# EasyEDA Pro project 嵌入式STC51测电压工程_2024_11_11.epro, board 测电压课设简单版本
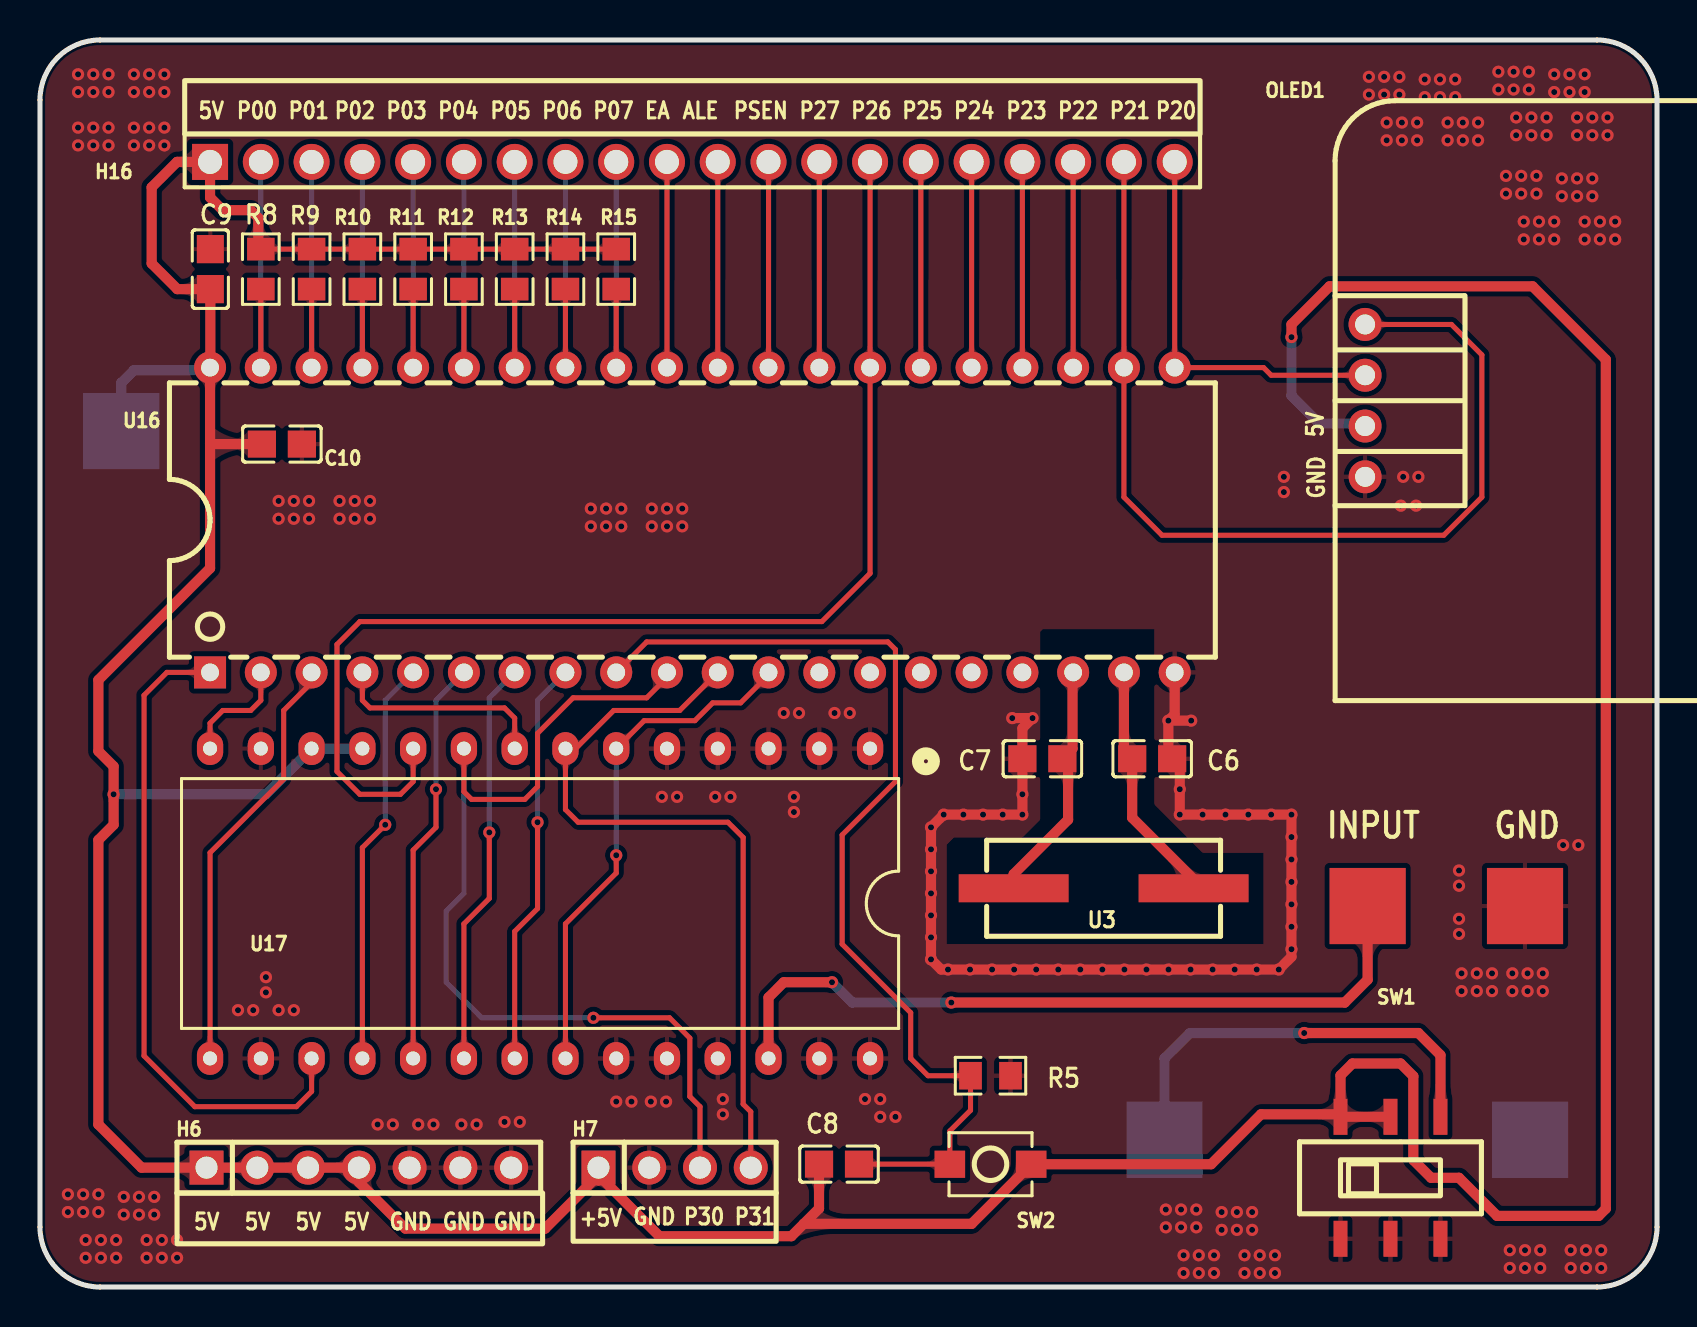
[diagram p1: board, top side]
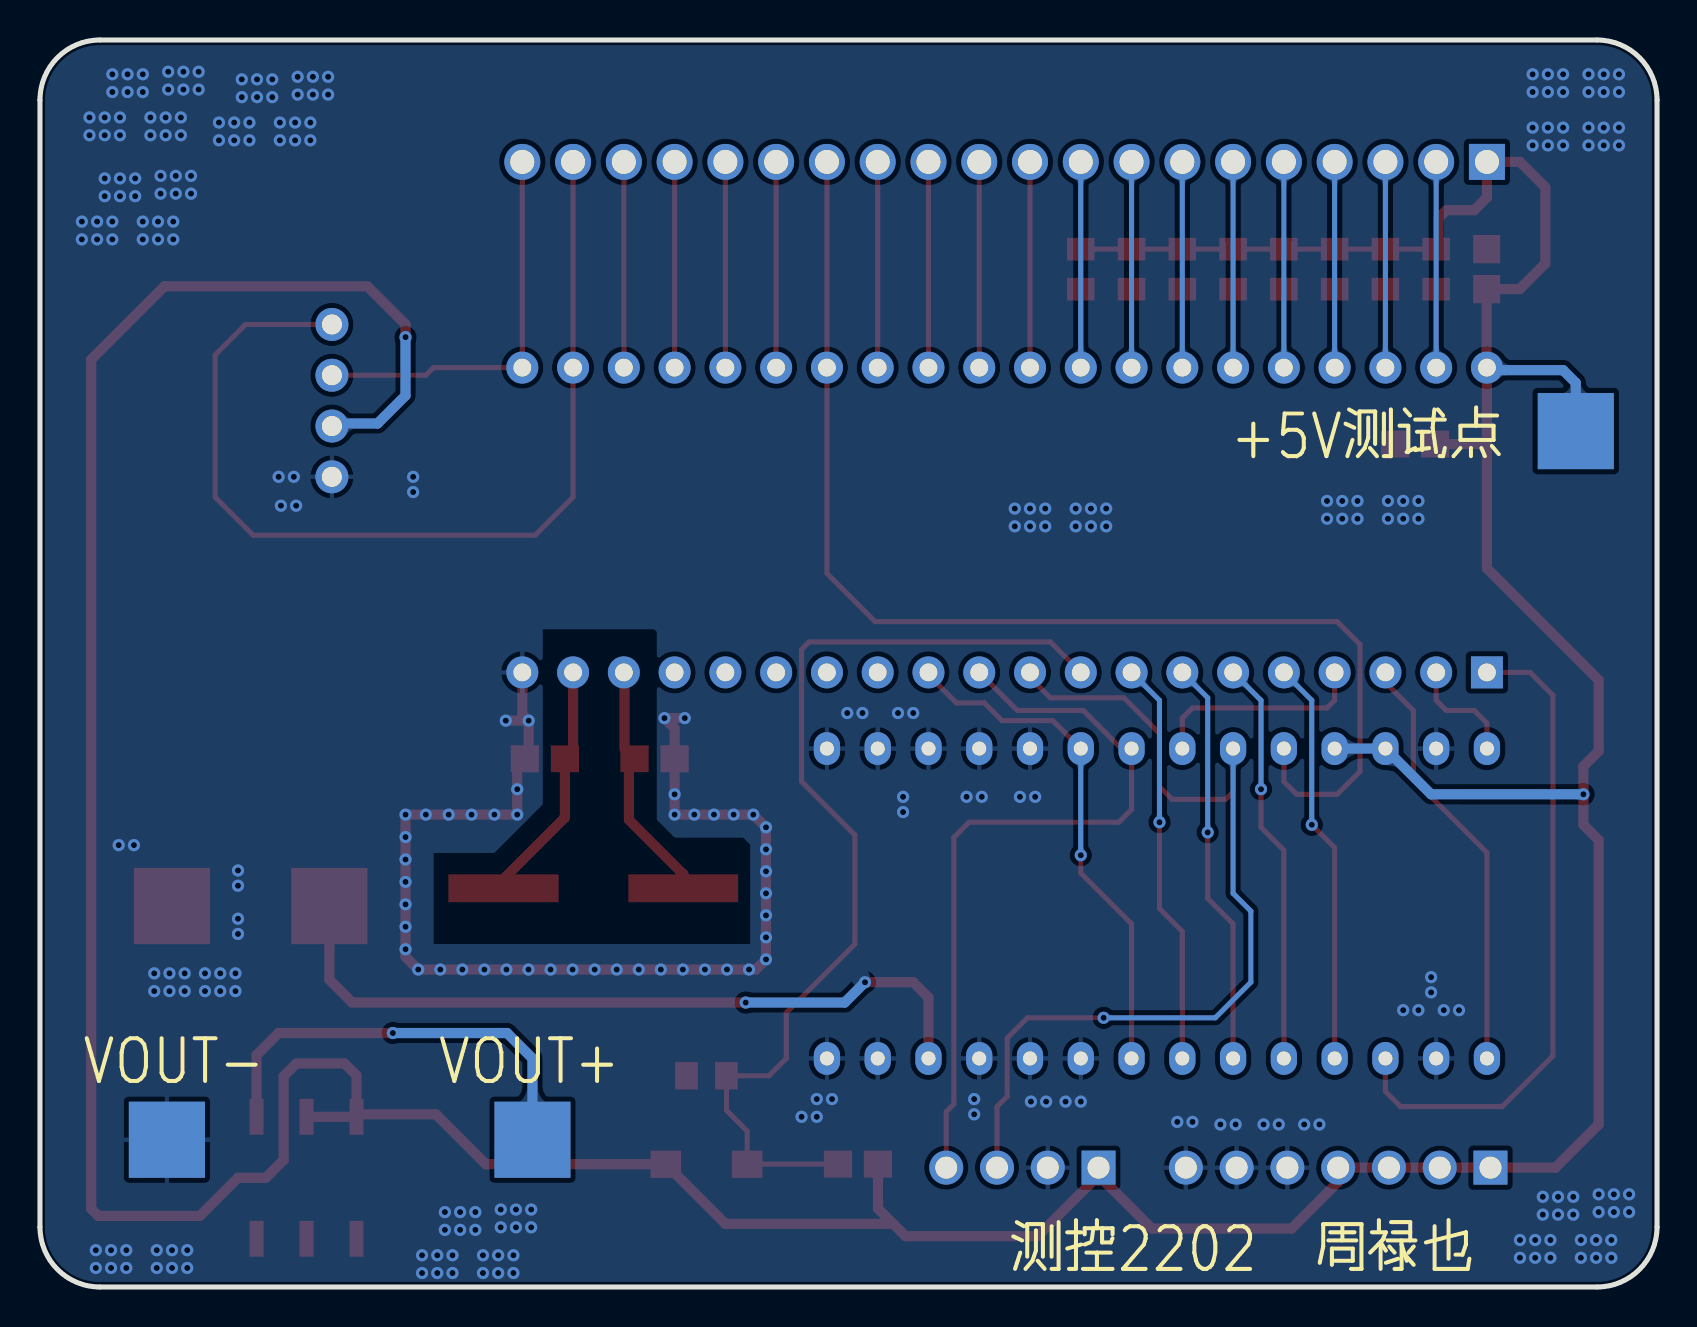
[diagram p2: board, bottom side, seen from below]

Outline 80.9 x 62.36 mm; copper layers: Top Layer, Bottom Layer. Coordinates in mm from the lower left corner of the outline.
Outline path: 0,59.36 0,3 arc(0.88,0.88) 3,0 77.9,0 arc(80.02,0.88) 80.9,3 80.9,59.36 arc(80.02,61.48) 77.9,62.36 3,62.36 arc(0.88,61.48) 0,59.36
Stack: Top Layer 0.035mm / Dielectric1 1.51mm FR4 er 4.5 / Bottom Layer 0.035mm

## Design rules (mm)
net XTAL1: DP1
net XTAL2: DP1
template: JLCPCB Capability(Two Layers Board)
spacing copperThickness1oz (default): track to track 0.102, other pairs 0.152 to 0.3
spacing copperThickness2oz: track to track 0.203, other pairs 0.152 to 0.3
track width copperThickness1oz (default): min 0.127, default 0.254, max 2.54
track width copperThickness2oz: min 0.203, default 0.254, max 2.54
differential pair differentialPair (default): width min 0.127, default 0.254, max 2.54; gap min 0.152, default 0.152
via viaSize (default): diameter min 0.5, default 0.61, max 10; hole min 0.3, default 0.305, max 6.3

## Placement (name value [footprint] x y rotation side)
C6  47PF  [C0805]  55.64 26.42 180 top
C7  47PF  [C0805]  50.15 26.42 0 top
C8  10uF  [C0805]  39.98 6.14 180 top
C9  100nF  [C0805]  8.52 50.9 90 top
C10  10uF  [C0805]  12.1 42.15 180 top
H6  -  [HDR-TH_7P-P2.54-V-M]  15.95 5.97 0 top
H7  -  [HDR-TH_4P-P2.54-V-M]  31.75 5.97 0 top
H16  -  [HDR-TH_20P-P2.54-V-M-1]  32.64 56.26 0 top
NOREF  -  [Pad_e1104]  74.55 7.37 0 top
NOREF#2  -  [Pad_e2425]  74.3 19.05 0 top
NOREF#3  -  [Pad_e1102]  56.26 7.37 0 top
NOREF#4  -  [Pad_e3894]  4.06 42.8 0 top
NOREF#5  -  [Pad_e2426]  66.42 19.05 0 top
OLED1  -  [0.96OLED_4P]  66.29 44.32 90 top
R5  10K  [R0805]  47.55 10.57 180 top
R8  5.1k  [R0805]  11.05 50.9 90 top
R9  5.1k  [R0805]  13.59 50.9 90 top
R10  5.1k  [R0805]  16.13 50.9 90 top
R11  5.1k  [R0805]  18.67 50.9 90 top
R12  5.1k  [R0805]  21.21 50.9 90 top
R13  5.1k  [R0805]  23.75 50.9 90 top
R14  5.1k  [R0805]  26.29 50.9 90 top
R15  5.1k  [R0805]  28.83 50.9 90 top
SW1  SS-3235S-L1  [SW-SMD_SS-3235S-LX]  67.56 5.46 180 top
SW2  轻触按键3*4*H  [SW-SMD_L4.0-W2.9-LS5.0]  47.55 6.14 180 top
U3  12MHz  [CRYSTAL-SMD_L11.4-W4.7-LS12.7]  53.21 19.94 0 top
U16  STC89C52RC-40I-PDIP40  [DIP-40_L52.0-W13.7-P2.54-LS15.2-BL]  32.64 38.35 0 top
U17  ADC0809CCN  [PDIP-28_L36.0-W13.0-P2.54-LS15.5-BL]  25.02 19.18 180 top

## Footprints (pads in the part's own frame, mm; a bottom-side part is the same pattern mirrored in y, then rotated)
0.96OLED_4P
  round 1.65 hole 1: 1(-3.81,-0.002) 2(-1.27,0.002) 3(1.27,0.002) 4(3.81,0.002)
C0805
  rect 1.41x1.35 smd: 1(-1,0) 2(1,0)
CRYSTAL-SMD_L11.4-W4.7-LS12.7
  rect 5.5x1.4 smd: 1(-4.5,0) 2(4.5,0)
DIP-40_L52.0-W13.7-P2.54-LS15.2-BL
  rect 1.6x1.6 hole 0.889: 1(-24.13,-7.62)
  round 1.6 hole 0.889: 2(-21.59,-7.62) 3(-19.05,-7.62) 4(-16.51,-7.62) 5(-13.97,-7.62) 6(-11.43,-7.62) 7(-8.89,-7.62) 8(-6.35,-7.62) 9(-3.81,-7.62) 10(-1.27,-7.62) 11(1.27,-7.62) 12(3.81,-7.62) 13(6.35,-7.62) 14(8.89,-7.62) 15(11.43,-7.62) 16(13.97,-7.62) 17(16.51,-7.62) 18(19.05,-7.62) 19(21.59,-7.62) 20(24.13,-7.62) 21(24.13,7.62) 22(21.59,7.62) 23(19.05,7.62) 24(16.51,7.62) 25(13.97,7.62) 26(11.43,7.62) 27(8.89,7.62) 28(6.35,7.62) 29(3.81,7.62) 30(1.27,7.62) 31(-1.27,7.62) 32(-3.81,7.62) 33(-6.35,7.62) 34(-8.89,7.62) 35(-11.43,7.62) 36(-13.97,7.62) 37(-16.51,7.62) 38(-19.05,7.62) 39(-21.59,7.62) 40(-24.13,7.62)
HDR-TH_4P-P2.54-V-M
  rect 1.7x1.7 hole 1.1: 1(-3.81,0)
  round 1.7 hole 1.1: 2(-1.27,0) 3(1.27,0) 4(3.81,0)
HDR-TH_7P-P2.54-V-M
  rect 1.7x1.7 hole 1.1: 1(-7.62,0)
  round 1.7 hole 1.1: 2(-5.08,0) 3(-2.54,0) 4(0,0) 5(2.54,0) 6(5.08,0) 7(7.62,0)
HDR-TH_20P-P2.54-V-M-1
  rect 1.8x1.8 hole 1.2: 1(-24.13,0)
  round 1.8 hole 1.2: 2(-21.59,0) 3(-19.05,0) 4(-16.51,0) 5(-13.97,0) 6(-11.43,0) 7(-8.89,0) 8(-6.35,0) 9(-3.81,0) 10(-1.27,0) 11(1.27,0) 12(3.81,0) 13(6.35,0) 14(8.89,0) 15(11.43,0) 16(13.97,0) 17(16.51,0) 18(19.05,0) 19(21.59,0) 20(24.13,0)
Pad_e1102
  rect 3.81x3.81 smd far side: 1(0,0)
Pad_e1104
  rect 3.81x3.81 smd far side: 1(0,0)
Pad_e2425
  rect 3.81x3.81 smd: 1(0,0)
Pad_e2426
  rect 3.81x3.81 smd: 1(0,0)
Pad_e3894
  rect 3.81x3.81 smd far side: 1(0,0)
PDIP-28_L36.0-W13.0-P2.54-LS15.5-BL
  oval 1.314x1.643 hole 0.7: 1(-16.51,-7.747) 2(-13.97,-7.747) 3(-11.43,-7.747) 4(-8.89,-7.747) 5(-6.35,-7.747) 6(-3.81,-7.747) 7(-1.27,-7.747) 8(1.27,-7.747) 9(3.81,-7.747) 10(6.35,-7.747) 11(8.89,-7.747) 12(11.43,-7.747) 13(13.97,-7.747) 14(16.51,-7.747) 15(16.51,7.747) 16(13.97,7.747) 17(11.43,7.747) 18(8.89,7.747) 19(6.35,7.747) 20(3.81,7.747) 21(1.27,7.747) 22(-1.27,7.747) 23(-3.81,7.747) 24(-6.35,7.747) 25(-8.89,7.747) 26(-11.43,7.747) 27(-13.97,7.747) 28(-16.51,7.747)
R0805
  rect 1.133x1.377 smd: 1(-1,0) 2(1,0)
SW-SMD_L4.0-W2.9-LS5.0
  rect 1.53x1.36 smd: 1(-2.035,0) 2(2.035,0)
SW-SMD_SS-3235S-LX
  rect 0.7x1.8 smd: 1(-2.5,3.05) 2(0,3.05) 3(2.5,3.05) 4(-2.5,-3.05) 5(0,-3.05) 6(2.5,-3.05)

## Nets
As in the schematic, except:
+5V: C8.2 C9.1 C10.2 H6.1 H6.2 H6.3 H6.4 H7.1 H16.1 NOREF#4.1 OLED1.2 R8.2 R9.2 R10.2 R11.2 R12.2 R13.2 R14.2 R15.2 SW1.5 SW1.6 SW2.1 U16.40 U17.11 U17.12
GND: C6.1 C7.1 C9.2 C10.1 H6.5 H6.6 H6.7 H7.2 NOREF.1 NOREF#2.1 OLED1.1 R5.1 SW1.1 SW1.2 SW1.3 U16.20 U17.1 U17.2 U17.3 U17.4 U17.5 U17.13 U17.16 U17.23 U17.24 U17.25 U17.27 U17.28
INPUT: NOREF#5.1 U17.26
P2.0: H16.20 OLED1.3 U16.21
P2.1: H16.19 OLED1.4 U16.22
VOUT+: NOREF#3.1 SW1.4

## Via types
v1: diameter 0.61, hole 0.305, Top Layer to Bottom Layer, 295 vias

## Routing (per net, layer and track width the routed paths; a pad name or vN(x,y) marks a point on that pad's centre or on a via; arc(x,y) is an arc through that point)
+5V: length 268.2
  Top Layer w0.254: R8.2 R9.2 R10.2 R11.2 R12.2 R13.2 R14.2 R15.2
  Top Layer w0.508: C8.2 38.98,3.92 38.21,3.16 ; 8.51,42.17 U16.40 8.52,45.99 C9.1 6.87,49.9 5.59,51.18 5.59,54.99 6.86,56.26 H16.1 8.51,54.48 9.14,53.85 10.54,53.85 10.92,53.47 10.92,52.03 R8.2 ; 8.51,42.17 8.53,42.15 C10.2 ; 8.51,42.17 8.51,35.94 2.92,30.35 2.92,26.8 3.68,26.04 v1(3.68,24.64) 3.68,23.11 2.92,22.35 2.92,8.13 5.08,5.97 H6.2 H6.4 15.95,5.25 18.28,2.92 25.27,2.92 27.69,5.33 27.94,5.33 ; 27.94,5.33 H7.1 ; 27.94,5.33 28.19,5.33 30.99,2.54 37.59,2.54 38.21,3.16 ; SW1.6 65.06,10.58 65.66,11.18 68.07,11.18 68.71,10.54 68.71,6.35 69.6,5.46 70.99,5.46 72.9,3.56 77.98,3.56 78.34,3.92 78.34,46.38 74.68,50.04 64.52,50.04 62.61,48.13 v1(62.61,47.5) ; SW1.6 64.94,8.64 61.09,8.64 58.59,6.14 SW2.1 46.61,3.16 38.21,3.16 ; SW1.6 SW1.5
  Bottom Layer w0.508: v1(3.68,24.64) 11.3,24.64 U17.12 U17.11 ; NOREF#4.1 4.06,45.21 4.7,45.85 8.38,45.85 U16.40 ; v1(62.61,47.5) 62.61,44.58 64.01,43.18 66.17,43.18 OLED1.2
GND: length 57.3
  Top Layer w0.508: v1(56.45,28.32) v1(57.59,28.32) ; v1(56.45,28.32) 56.45,26.61 C6.1 57.02,26.04 v1(57.02,24.89) v1(57.02,23.62) v1(58.17,23.62) v1(59.31,23.62) v1(60.45,23.62) v1(61.6,23.62) v1(62.61,23.62) v1(62.61,22.5) v1(62.61,21.38) v1(62.61,20.26) v1(62.61,19.13) v1(62.61,18.01) v1(62.61,16.89) 62.61,16.51 v1(61.98,15.88) v1(60.87,15.88) v1(59.77,15.88) v1(58.67,15.88) v1(57.56,15.88) v1(56.46,15.88) v1(55.36,15.88) v1(54.25,15.88) v1(53.15,15.88) v1(52.05,15.88) v1(50.94,15.88) v1(49.84,15.88) v1(48.74,15.88) v1(47.63,15.88) v1(46.53,15.88) v1(45.43,15.88) 45.08,15.88 v1(44.58,16.38) v1(44.58,17.48) v1(44.58,18.58) v1(44.58,19.69) v1(44.58,20.79) v1(44.58,21.89) v1(44.58,22.99) v1(45.21,23.62) v1(46.2,23.62) v1(47.18,23.62) v1(48.17,23.62) v1(49.15,23.62) v1(49.15,24.64) C7.1 49.15,27.94 v1(49.66,28.45) v1(48.64,28.45) ; v1(56.45,28.32) 56.77,28.64 U16.20
  vias: v1(1.4,4.64) v1(1.4,3.75) v1(1.91,60.64) v1(1.91,59.75) v1(1.91,57.98) v1(1.91,57.09) v1(2.16,4.64) v1(2.16,3.75) v1(2.29,2.35) v1(2.29,1.46) v1(2.67,60.64) v1(2.67,59.75) v1(2.67,57.98) v1(2.67,57.09) v1(2.92,4.64) v1(2.92,3.75) v1(3.05,2.35) v1(3.05,1.46) v1(3.43,60.64) v1(3.43,59.75) v1(3.43,57.98) v1(3.43,57.09) v1(3.81,2.35) v1(3.81,1.46) v1(4.19,4.51) v1(4.19,3.62) v1(4.7,60.64) v1(4.7,59.75) v1(4.7,57.98) v1(4.7,57.09) v1(4.95,4.51) v1(4.95,3.62) v1(5.33,2.35) v1(5.33,1.46) v1(5.46,60.64) v1(5.46,59.75) v1(5.46,57.98) v1(5.46,57.09) v1(5.72,4.51) v1(5.72,3.62) v1(6.1,2.35) v1(6.1,1.46) v1(6.22,60.64) v1(6.22,59.75) v1(6.22,57.98) v1(6.22,57.09) v1(6.86,2.35) v1(6.86,1.46) v1(9.91,13.84) v1(10.67,13.84) v1(11.3,15.49) v1(11.3,14.73) v1(11.94,39.31) v1(11.94,38.42) v1(11.94,13.84) v1(12.7,39.31) v1(12.7,38.42) v1(12.7,13.84) v1(13.46,39.31) v1(13.46,38.42) v1(14.99,39.31) v1(14.99,38.42) v1(15.75,39.31) v1(15.75,38.42) v1(16.51,39.31) v1(16.51,38.42) v1(16.89,8.13) v1(17.65,8.13) v1(18.92,8.13) v1(19.69,8.13) v1(21.08,8.13) v1(21.84,8.13) v1(23.24,8.26) v1(24,8.26) v1(27.56,38.93) v1(27.56,38.04) v1(28.32,38.93) v1(28.32,38.04) v1(28.83,9.27) v1(29.08,38.93) v1(29.08,38.04) v1(29.59,9.27) v1(30.61,38.93) v1(30.61,38.04) v1(30.56,9.27) v1(31.11,24.51) v1(31.37,38.93) v1(31.37,38.04) v1(31.32,9.27) v1(31.87,24.51) v1(32.13,38.93) v1(32.13,38.04) v1(33.78,24.51) v1(34.16,9.4) v1(34.16,8.64) v1(34.54,24.51) v1(37.21,28.7) v1(37.72,24.51) v1(37.72,23.75) v1(37.97,28.7) v1(39.75,28.7) v1(40.51,28.7) v1(41.27,9.4) v1(42.04,9.4) v1(42.04,8.51) v1(42.8,8.51) v1(56.32,3.87) v1(56.32,2.98) v1(57.09,3.87) v1(57.09,2.98) v1(57.21,1.59) v1(57.21,0.7) v1(57.85,3.87) v1(57.85,2.98) v1(57.98,1.59) v1(57.98,0.7) v1(58.74,1.59) v1(58.74,0.7) v1(59.12,3.75) v1(59.12,2.86) v1(59.88,3.75) v1(59.88,2.86) v1(60.26,1.59) v1(60.26,0.7) v1(60.64,3.75) v1(60.64,2.86) v1(61.02,1.59) v1(61.02,0.7) v1(61.79,1.59) v1(61.79,0.7) v1(62.23,40.51) v1(62.23,39.75) v1(66.48,60.52) v1(66.48,59.63) v1(67.25,60.52) v1(67.25,59.63) v1(67.37,58.23) v1(67.37,57.34) v1(68.01,60.52) v1(68.01,59.63) v1(68.08,39.07) v1(68.14,58.23) v1(68.14,57.34) v1(68.2,40.51) v1(68.9,58.23) v1(68.9,57.34) v1(68.85,39.07) v1(68.96,40.51) v1(69.28,60.39) v1(69.28,59.5) v1(70.04,60.39) v1(70.04,59.5) v1(70.42,58.23) v1(70.42,57.34) v1(70.8,60.39) v1(70.8,59.5) v1(70.99,20.83) v1(70.99,20.07) v1(70.99,18.42) v1(70.99,17.65) v1(71.12,15.68) v1(71.12,14.8) v1(71.18,58.23) v1(71.18,57.34) v1(71.88,15.68) v1(71.88,14.8) v1(71.95,58.23) v1(71.95,57.34) v1(72.64,15.68) v1(72.64,14.8) v1(72.96,60.77) v1(72.96,59.88) v1(73.34,55.56) v1(73.34,54.67) v1(73.53,1.84) v1(73.53,0.95) v1(73.66,15.68) v1(73.66,14.8) v1(73.72,60.77) v1(73.72,59.88) v1(73.85,58.48) v1(73.85,57.59) v1(74.1,55.56) v1(74.1,54.67) v1(74.23,53.28) v1(74.23,52.39) v1(74.3,1.84) v1(74.3,0.95) v1(74.42,15.68) v1(74.42,14.8) v1(74.49,60.77) v1(74.49,59.88) v1(74.61,58.48) v1(74.61,57.59) v1(74.87,55.56) v1(74.87,54.67) v1(74.99,53.28) v1(74.99,52.39) v1(75.06,1.84) v1(75.06,0.95) v1(75.18,15.68) v1(75.18,14.8) v1(75.37,58.48) v1(75.37,57.59) v1(75.76,60.64) v1(75.76,59.75) v1(75.76,53.28) v1(75.76,52.39) v1(76.14,55.44) v1(76.14,54.55) v1(76.2,22.1) v1(76.52,60.64) v1(76.52,59.75) v1(76.58,1.84) v1(76.58,0.95) v1(76.9,58.48) v1(76.9,57.59) v1(76.9,55.44) v1(76.9,54.55) v1(76.96,22.1) v1(77.28,60.64) v1(77.28,59.75) v1(77.28,53.28) v1(77.28,52.39) v1(77.34,1.84) v1(77.34,0.95) v1(77.66,58.48) v1(77.66,57.59) v1(77.66,55.44) v1(77.66,54.55) v1(78.04,53.28) v1(78.04,52.39) v1(78.11,1.84) v1(78.11,0.95) v1(78.42,58.48) v1(78.42,57.59) v1(78.8,53.28) v1(78.8,52.39)
ALE: length 10.3
  Top Layer w0.254: H16.11 U16.30
EA: length 10.3
  Top Layer w0.254: H16.10 U16.31
INPUT: length 37.9
  Top Layer w0.508: U17.26 36.45,14.48 37.21,15.24 v1(39.62,15.24) ; v1(45.59,14.22) 65.28,14.22 66.42,15.37 NOREF#5.1
  Bottom Layer w0.508: v1(45.59,14.22) 40.64,14.22 v1(39.62,15.24)
P0.0: length 14.2
  Top Layer w0.254: U16.39 R8.1
  Bottom Layer w0.254: H16.2 U16.39
P0.1: length 14.2
  Top Layer w0.254: U16.38 R9.1
  Bottom Layer w0.254: H16.3 U16.38
P0.2: length 14.2
  Top Layer w0.254: U16.37 R10.1
  Bottom Layer w0.254: H16.4 U16.37
P0.3: length 14.2
  Top Layer w0.254: U16.36 R11.1
  Bottom Layer w0.254: H16.5 U16.36
P0.4: length 14.2
  Top Layer w0.254: U16.35 R12.1
  Bottom Layer w0.254: H16.6 U16.35
P0.5: length 14.2
  Top Layer w0.254: U16.34 R13.1
  Bottom Layer w0.254: H16.7 U16.34
P0.6: length 14.2
  Top Layer w0.254: U16.33 R14.1
  Bottom Layer w0.254: H16.8 U16.33
P0.7: length 14.2
  Top Layer w0.254: U16.32 R15.1
  Bottom Layer w0.254: H16.9 U16.32
P1.0: length 33.2
  Top Layer w0.254: U16.1 6.35,30.73 5.21,29.59 5.21,11.56 7.75,9.02 12.83,9.02 13.59,9.78 U17.17
P1.1: length 5.7
  Top Layer w0.254: U16.2 11.05,29.34 10.54,28.83 9.14,28.83 8.51,28.19 U17.14
P1.2: length 21.4
  Top Layer w0.254: U17.15 8.51,21.72 12.19,25.4 12.19,28.83 13.59,30.23 U16.3
P1.3: length 10.9
  Top Layer w0.254: U17.8 23.75,28.45 23.24,28.96 16.51,28.96 16.13,29.34 U16.4
P1.4: length 20.4
  Top Layer w0.254: U17.18 16.13,21.97 v1(17.27,23.11)
  Bottom Layer w0.254: v1(17.27,23.11) 17.27,29.34 U16.5
P1.5: length 20.4
  Top Layer w0.254: U17.19 18.67,21.84 19.81,22.99 v1(19.81,24.89)
  Bottom Layer w0.254: v1(19.81,24.89) 19.81,29.34 U16.6
P1.6: length 20.4
  Top Layer w0.254: U17.20 21.21,18.16 22.48,19.43 v1(22.48,22.73)
  Bottom Layer w0.254: v1(22.48,22.73) 22.48,29.46 U16.7
P1.7: length 20.4
  Top Layer w0.254: v1(24.89,23.24) 24.89,18.92 23.75,17.78 U17.21
  Bottom Layer w0.254: U16.8 24.89,29.34 v1(24.89,23.24)
P2.0: length 20
  Top Layer w0.254: H16.20 U16.21 61.21,45.97 61.6,45.59 OLED1.3
P2.1: length 49.8
  Top Layer w0.254: OLED1.4 70.61,48.13 72.14,46.61 72.14,39.5 70.23,37.59 56.13,37.59 54.23,39.5 U16.22 H16.19
P2.2: length 10.3
  Top Layer w0.254: H16.18 U16.23
P2.3: length 10.3
  Top Layer w0.254: H16.17 U16.24
P2.4: length 10.3
  Top Layer w0.254: H16.16 U16.25
P2.5: length 10.3
  Top Layer w0.254: H16.15 U16.26
P2.6: length 61.3
  Top Layer w0.254: U17.10 18.67,25.27 18.03,24.64 16,24.64 14.86,25.78 14.86,32.13 16,33.27 39.12,33.27 41.53,35.69 U16.27 H16.14
P2.7: length 10.3
  Top Layer w0.254: H16.13 U16.28
P3.0: length 48.9
  Top Layer w0.254: U16.10 31.37,30.48 30.35,29.46 26.67,29.46 24.89,27.69 24.89,25.02 24.26,24.38 21.59,24.38 21.21,24.77 U17.9 ; v1(27.69,13.46) 31.5,13.46 32.51,12.45 32.51,9.53 33.02,9.02 H7.3
  Bottom Layer w0.254: v1(27.69,13.46) 22.1,13.46 20.32,15.24 20.32,18.8 21.21,19.69 U17.9
P3.1: length 38.4
  Top Layer w0.254: H7.4 35.56,8.76 35.18,9.14 35.18,22.48 34.42,23.24 26.92,23.24 26.29,23.88 U17.7 26.8,26.92 28.7,28.83 32,28.83 U16.11
P3.2: length 25.8
  Top Layer w0.254: U17.22 26.29,18.16 28.83,20.7 v1(28.83,21.59) ; U17.6 30.23,28.32 32.77,28.32 33.66,29.21 35.05,29.21 36.45,30.61 U16.12
  Bottom Layer w0.254: v1(28.83,21.59) U17.6
PSEN: length 10.3
  Top Layer w0.254: H16.12 U16.29
RST: length 50.5
  Top Layer w0.254: C8.1 45.51,6.14 SW2.2 45.52,7.8 46.55,8.84 R5.2 44.42,10.57 43.56,11.43 43.56,13.72 40.13,17.15 40.13,22.61 42.8,25.27 42.8,31.88 42.42,32.26 30.35,32.26 U16.9
VOUT+: length 21.9
  Top Layer w0.508: SW1.4 70.06,11.6 68.96,12.7 v1(63.25,12.7)
  Bottom Layer w0.508: NOREF#3.1 56.26,11.43 57.53,12.7 v1(63.25,12.7)
XTAL1: length 12.2
  Top Layer w0.508: U3.2 57.71,20.39 54.64,23.46 C6.2 54.23,26.83 U16.19
XTAL2: length 12.3
  Top Layer w0.508: U16.18 51.66,30.7 51.66,26.92 C7.2 51.44,26.13 51.44,23.37 48.71,20.65 U3.1

## Copper pours and planes (outline as drawn; the poured copper is in the pictures)
GND on Top Layer: -2.03,64.39 82.8,64.39 82.8,-2.29 -2.03,-2.29
GND on Top Layer: 12.45,50.42 93.35,50.42 93.35,-11.68 12.45,-11.68
GND on Bottom Layer: -2.92,63.5 84.33,63.5 84.33,-3.05 -2.92,-3.05
GND on Bottom Layer: 9.78,52.32 96.9,52.32 96.9,-14.22 9.78,-14.22

Small or netless copper shapes (teardrops, artwork), in the pictures only: 167 on Top Layer, 39 on Bottom Layer

## Text on the board
Bottom Silkscreen Layer: VOUT+ | VOUT- | +5V测试点 | 测控2202  周禄也
Top Silkscreen Layer: 5V | P00 | P01 | P02 | P03 | GND | P04 | P05 | P06 | +5V | P07 | EA | ALE | P30 | PSEN | P31 | P27 | P26 | P25 | P24 | P23 | P22 | P21 | P20 | INPUT
